# EAGLE design untitled (EAGLE 7.0.0)
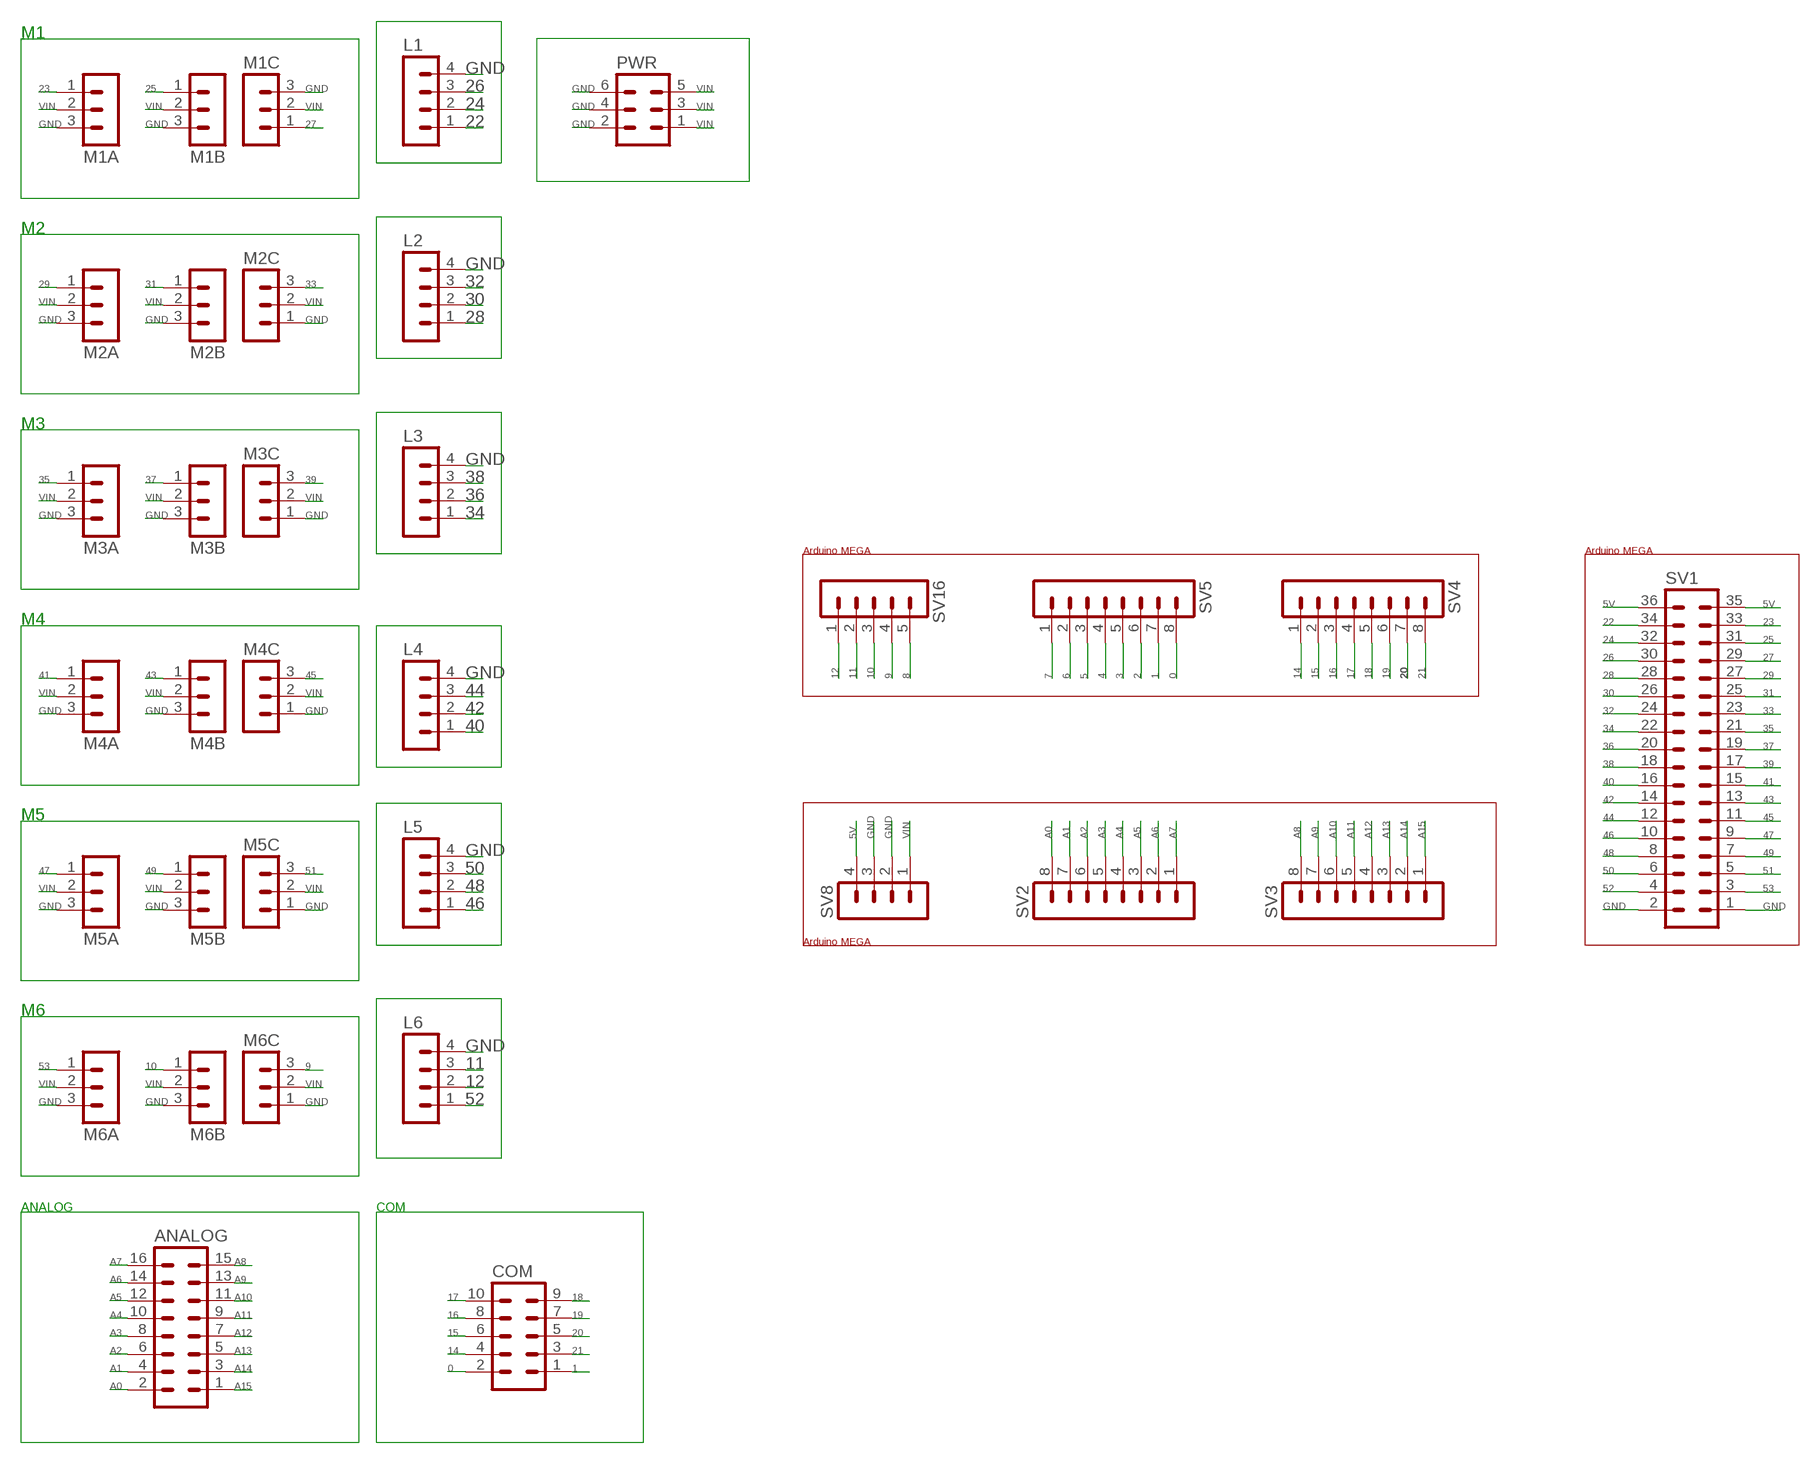
[diagram p0: schematic, sheet 1]

## Parts
ANALOG  MA08-2  [MA08-2]
COM  MA05-2  [MA05-2]
L1  MA04-1  [MA04-1]
L2  MA04-1  [MA04-1]
L3  MA04-1  [MA04-1]
L4  MA04-1  [MA04-1]
L5  MA04-1  [MA04-1]
L6  MA04-1  [MA04-1]
M1A  MA03-1  [MA03-1]
M1B  MA03-1  [MA03-1]
M1C  MA03-1  [MA03-1]
M2A  MA03-1  [MA03-1]
M2B  MA03-1  [MA03-1]
M2C  MA03-1  [MA03-1]
M3A  MA03-1  [MA03-1]
M3B  MA03-1  [MA03-1]
M3C  MA03-1  [MA03-1]
M4A  MA03-1  [MA03-1]
M4B  MA03-1  [MA03-1]
M4C  MA03-1  [MA03-1]
M5A  MA03-1  [MA03-1]
M5B  MA03-1  [MA03-1]
M5C  MA03-1  [MA03-1]
M6A  MA03-1  [MA03-1]
M6B  MA03-1  [MA03-1]
M6C  MA03-1  [MA03-1]
PWR  MA03-2  [MA03-2]
SV1  MA18-2  [MA18-2]
SV2  MA08-1  [MA08-1]
SV3  MA08-1  [MA08-1]
SV4  MA08-1  [MA08-1]
SV5  MA08-1  [MA08-1]
SV8  MA04-1  [MA04-1]
SV16  MA05-1  [MA05-1]

## Nets
0: COM.2 SV5.8
1: COM.1 SV5.7
2: SV5.6
3: SV5.5
4: SV5.4
5: SV5.3
5V: SV1.35 SV1.36 SV8.4
6: SV5.2
7: SV5.1
8: SV16.5
9: M6C.3 SV16.4
10: M6B.1 SV16.3
11: L6.3 SV16.2
12: L6.2 SV16.1
14: COM.4 SV4.1
15: COM.6 SV4.2
16: COM.8 SV4.3
17: COM.10 SV4.4
18: COM.9 SV4.5
19: COM.7 SV4.6
20: COM.5 SV4.7
21: COM.3 SV4.8
22: L1.1 SV1.34
23: M1A.1 SV1.33
24: L1.2 SV1.32
25: M1B.1 SV1.31
26: L1.3 SV1.30
27: M1C.1 SV1.29
28: L2.1 SV1.28
29: M2A.1 SV1.27
30: L2.2 SV1.26
31: M2B.1 SV1.25
32: L2.3 SV1.24
33: M2C.3 SV1.23
34: L3.1 SV1.22
35: M3A.1 SV1.21
36: L3.2 SV1.20
37: M3B.1 SV1.19
38: L3.3 SV1.18
39: M3C.3 SV1.17
40: L4.1 SV1.16
41: M4A.1 SV1.15
42: L4.2 SV1.14
43: M4B.1 SV1.13
44: L4.3 SV1.12
45: M4C.3 SV1.11
46: L5.1 SV1.10
47: M5A.1 SV1.9
48: L5.2 SV1.8
49: M5B.1 SV1.7
50: L5.3 SV1.6
51: M5C.3 SV1.5
52: L6.1 SV1.4
53: M6A.1 SV1.3
A0: ANALOG.2 SV2.8
A1: ANALOG.4 SV2.7
A2: ANALOG.6 SV2.6
A3: ANALOG.8 SV2.5
A4: ANALOG.10 SV2.4
A5: ANALOG.12 SV2.3
A6: ANALOG.14 SV2.2
A7: ANALOG.16 SV2.1
A8: ANALOG.15 SV3.8
A9: ANALOG.13 SV3.7
A10: ANALOG.11 SV3.6
A11: ANALOG.9 SV3.5
A12: ANALOG.7 SV3.4
A13: ANALOG.5 SV3.3
A14: ANALOG.3 SV3.2
A15: ANALOG.1 SV3.1
GND: L1.4 L2.4 L3.4 L4.4 L5.4 L6.4 M1A.3 M1B.3 M1C.3 M2A.3 M2B.3 M2C.1 M3A.3 M3B.3 M3C.1 M4A.3 M4B.3 M4C.1 M5A.3 M5B.3 M5C.1 M6A.3 M6B.3 M6C.1 PWR.2 PWR.4 PWR.6 SV1.1 SV1.2 SV8.2 SV8.3
VIN: M1A.2 M1B.2 M1C.2 M2A.2 M2B.2 M2C.2 M3A.2 M3B.2 M3C.2 M4A.2 M4B.2 M4C.2 M5A.2 M5B.2 M5C.2 M6A.2 M6B.2 M6C.2 PWR.1 PWR.3 PWR.5 SV8.1

## Notes on the sheet
- M1
- M2
- M3
- Arduino MEGA | Arduino MEGA
- M4
- M5
- Arduino MEGA
- M6
- ANALOG | COM

## Library data of the parts
ANALOG = con-lstb:MA08-2: PIN HEADER; OC_FARNELL: unknown; OC_NEWARK: unknown
COM = con-lstb:MA05-2: PIN HEADER; OC_FARNELL: unknown; OC_NEWARK: unknown
L1-L6 SV8 = con-lstb:MA04-1: PIN HEADER; OC_FARNELL: unknown; OC_NEWARK: unknown
M1A M1B M1C M2A M2B M2C M3A M3B M3C M4A M4B M4C M5A M5B M5C M6A M6B M6C = con-lstb:MA03-1: PIN HEADER; OC_FARNELL: unknown; OC_NEWARK: unknown
PWR = con-lstb:MA03-2: PIN HEADER; OC_FARNELL: unknown; OC_NEWARK: unknown
SV1 = con-lstb:MA18-2: PIN HEADER; OC_FARNELL: unknown; OC_NEWARK: unknown
SV2-SV5 = con-lstb:MA08-1: PIN HEADER; OC_FARNELL: unknown; OC_NEWARK: unknown
SV16 = con-lstb:MA05-1: PIN HEADER; OC_FARNELL: unknown; OC_NEWARK: unknown

## Board
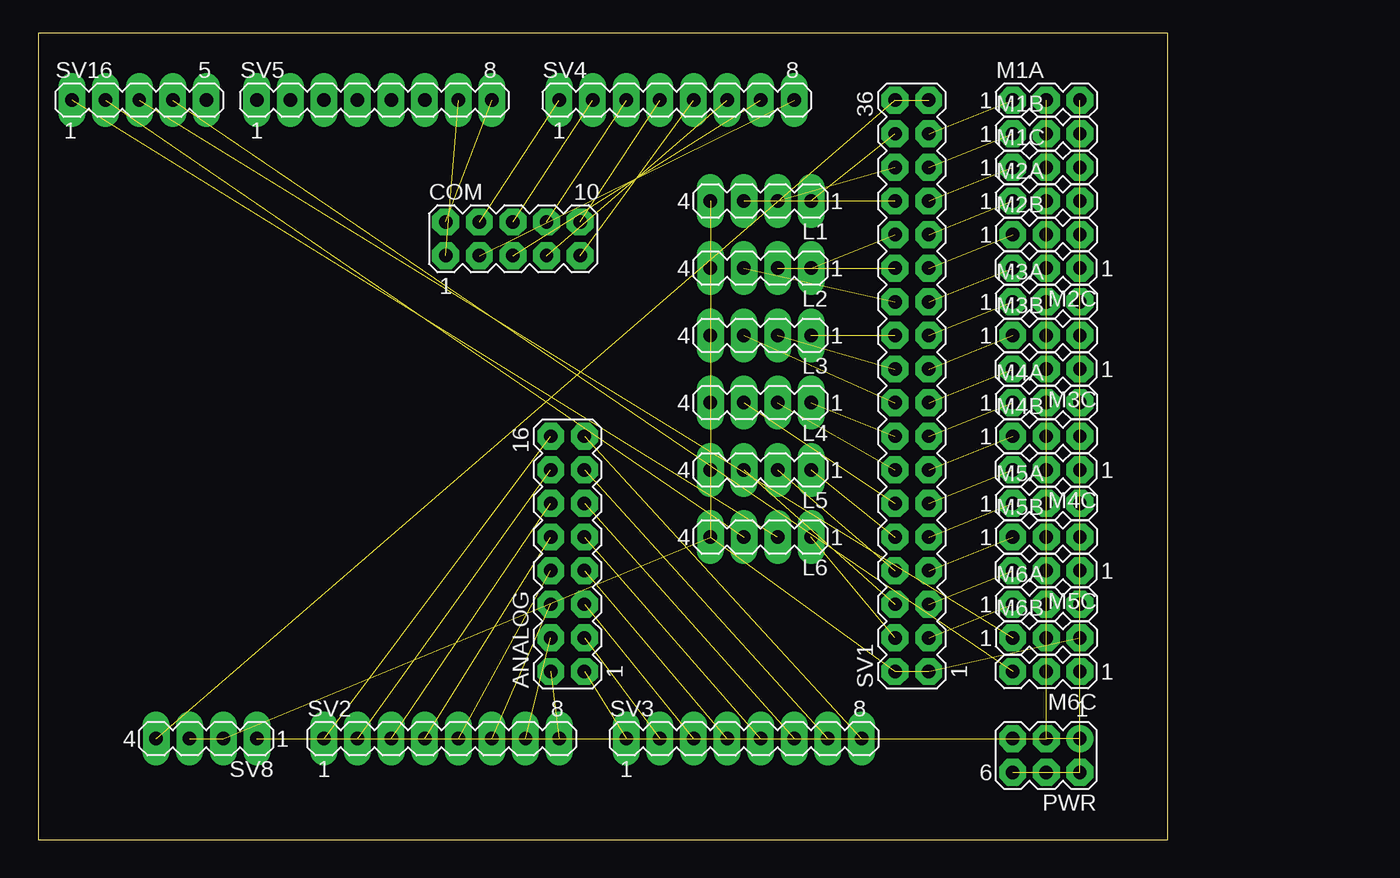
[diagram p1: board, top side]
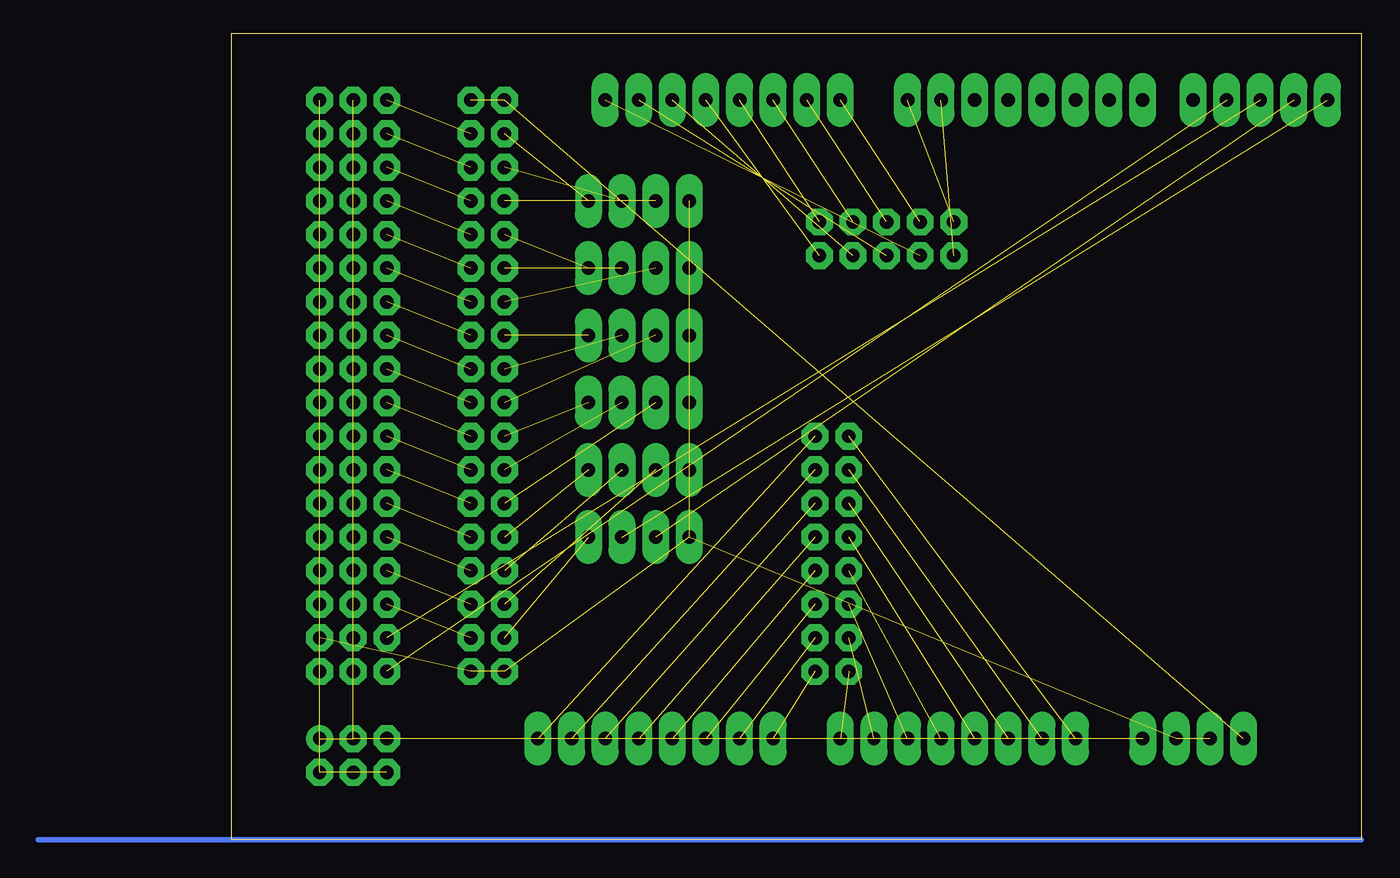
[diagram p2: board, bottom side, seen from below]

Size 85.39 x 60.95 mm. Coordinates in mm from the lower left corner, seen from the top.
Outline: 0,0 85.39,0 85.39,60.95 0,60.95 0,0
Copper layers (1*16): Top 0.035mm / dielectric 1.5mm / Bottom 0.035mm
Design rules "default *": minimum track width 16mil, minimum drill 0.6mm, track to track 16mil, track to pad 16mil, pad to pad 16mil, via to via 16mil, smd to smd 8mil, copper to edge 40mil, drill to drill 8mil, minimum pad ring 20mil, minimum via ring 16mil, stop-mask expansion 4mil, vias tented up to drill 0mil, thermal gap 10mil

### Footprints (pad centres in the part's own frame; a part is rotated, then mirrored left to right if it is on the bottom)
MA08-2 = drill 1.016 octagon: 1 -8.89,-1.27; 2 -8.89,1.27; 3 -6.35,-1.27; 4 -6.35,1.27; 5 -3.81,-1.27; 6 -3.81,1.27; 7 -1.27,-1.27; 8 -1.27,1.27; 9 1.27,-1.27; 10 1.27,1.27; 11 3.81,-1.27; 12 3.81,1.27; 13 6.35,-1.27; 14 6.35,1.27; 15 8.89,-1.27; 16 8.89,1.27
MA05-2 = drill 1.016 octagon: 1 -5.08,-1.27; 2 -5.08,1.27; 3 -2.54,-1.27; 4 -2.54,1.27; 5 0,-1.27; 6 0,1.27; 7 2.54,-1.27; 8 2.54,1.27; 9 5.08,-1.27; 10 5.08,1.27
MA04-1 = drill 1.016 long: 1 -3.81,0; 2 -1.27,0; 3 1.27,0; 4 3.81,0
MA03-1 = drill 1.016 octagon: 1 -2.54,0; 2 0,0; 3 2.54,0
MA03-2 = drill 1.016: 1 -2.54,-1.27 | drill 1.016 octagon: 2 -2.54,1.27; 3 0,-1.27; 4 0,1.27; 5 2.54,-1.27; 6 2.54,1.27
MA18-2 = drill 1.016 octagon: 1 -21.59,-1.27; 2 -21.59,1.27; 3 -19.05,-1.27; 4 -19.05,1.27; 5 -16.51,-1.27; 6 -16.51,1.27; 7 -13.97,-1.27; 8 -13.97,1.27; 9 -11.43,-1.27; 10 -11.43,1.27; 11 -8.89,-1.27; 12 -8.89,1.27; 13 -6.35,-1.27; 14 -6.35,1.27; 15 -3.81,-1.27; 16 -3.81,1.27; 17 -1.27,-1.27; 18 -1.27,1.27; 19 1.27,-1.27; 20 1.27,1.27; 21 3.81,-1.27; 22 3.81,1.27; 23 6.35,-1.27; 24 6.35,1.27; 25 8.89,-1.27; 26 8.89,1.27; 27 11.43,-1.27; 28 11.43,1.27; 29 13.97,-1.27; 30 13.97,1.27; 31 16.51,-1.27; 32 16.51,1.27; 33 19.05,-1.27; 34 19.05,1.27; 35 21.59,-1.27; 36 21.59,1.27
MA08-1 = drill 1.016 long: 1 -8.89,0; 2 -6.35,0; 3 -3.81,0; 4 -1.27,0; 5 1.27,0; 6 3.81,0; 7 6.35,0; 8 8.89,0
MA05-1 = drill 1.016 long: 1 -5.08,0; 2 -2.54,0; 3 0,0; 4 2.54,0; 5 5.08,0

### Placement (x,y rotation side)
ANALOG  40.01,21.59 90 top
COM  35.88,45.4 0 top
L1  54.61,48.26 180 top
L2  54.61,43.18 180 top
L3  54.61,38.1 180 top
L4  54.61,33.02 180 top
L5  54.61,27.94 180 top
L6  54.61,22.86 180 top
M1A  76.2,55.88 0 top
M1B  76.2,53.34 0 top
M1C  76.2,50.8 0 top
M2A  76.2,48.26 0 top
M2B  76.2,45.72 0 top
M2C  76.2,43.18 180 top
M3A  76.2,40.64 0 top
M3B  76.2,38.1 0 top
M3C  76.2,35.56 180 top
M4A  76.2,33.02 0 top
M4B  76.2,30.48 0 top
M4C  76.2,27.94 180 top
M5A  76.2,25.4 0 top
M5B  76.2,22.86 0 top
M5C  76.2,20.32 180 top
M6A  76.2,17.78 0 top
M6B  76.2,15.24 0 top
M6C  76.2,12.7 180 top
PWR  76.2,6.35 180 top
SV1  66.04,34.29 90 top
SV2  30.48,7.62 0 top
SV3  53.34,7.62 0 top
SV4  48.26,55.88 0 top
SV5  25.4,55.88 0 top
SV8  12.7,7.62 180 top
SV16  7.62,55.88 0 top

### Tracks (layer width: path | path; a pad name or v marks a point on that pad's centre or on a via)
0  (1 unrouted)
1  (1 unrouted)
5V  (2 unrouted)
9  (1 unrouted)
10  (1 unrouted)
11  (1 unrouted)
12  (1 unrouted)
14  (1 unrouted)
15  (1 unrouted)
16  (1 unrouted)
17  (1 unrouted)
18  (1 unrouted)
19  (1 unrouted)
20  (1 unrouted)
21  (1 unrouted)
22  (1 unrouted)
23  (1 unrouted)
24  (1 unrouted)
25  (1 unrouted)
26  (1 unrouted)
27  (1 unrouted)
28  (1 unrouted)
29  (1 unrouted)
30  (1 unrouted)
31  (1 unrouted)
32  (1 unrouted)
33  (1 unrouted)
34  (1 unrouted)
35  (1 unrouted)
36  (1 unrouted)
37  (1 unrouted)
38  (1 unrouted)
39  (1 unrouted)
40  (1 unrouted)
41  (1 unrouted)
42  (1 unrouted)
43  (1 unrouted)
44  (1 unrouted)
45  (1 unrouted)
46  (1 unrouted)
47  (1 unrouted)
48  (1 unrouted)
49  (1 unrouted)
50  (1 unrouted)
51  (1 unrouted)
52  (1 unrouted)
53  (1 unrouted)
A0  (1 unrouted)
A1  (1 unrouted)
A2  (1 unrouted)
A3  (1 unrouted)
A4  (1 unrouted)
A5  (1 unrouted)
A6  (1 unrouted)
A7  (1 unrouted)
A8  (1 unrouted)
A9  (1 unrouted)
A10  (1 unrouted)
A11  (1 unrouted)
A12  (1 unrouted)
A13  (1 unrouted)
A14  (1 unrouted)
A15  (1 unrouted)
GND  (30 unrouted)
N$1
  Bottom 0.406: 0,0 100,0
VIN  (21 unrouted)